# Altium schematic sheet cronometroArduino.SchDoc: CRONÓMETRO SUMO-MINISUMO
size 420 x 297 mm; Date: 11/05/2024; Author: I+D; CompanyName: IEEE; SheetNumber: 1; SheetTotal: 1
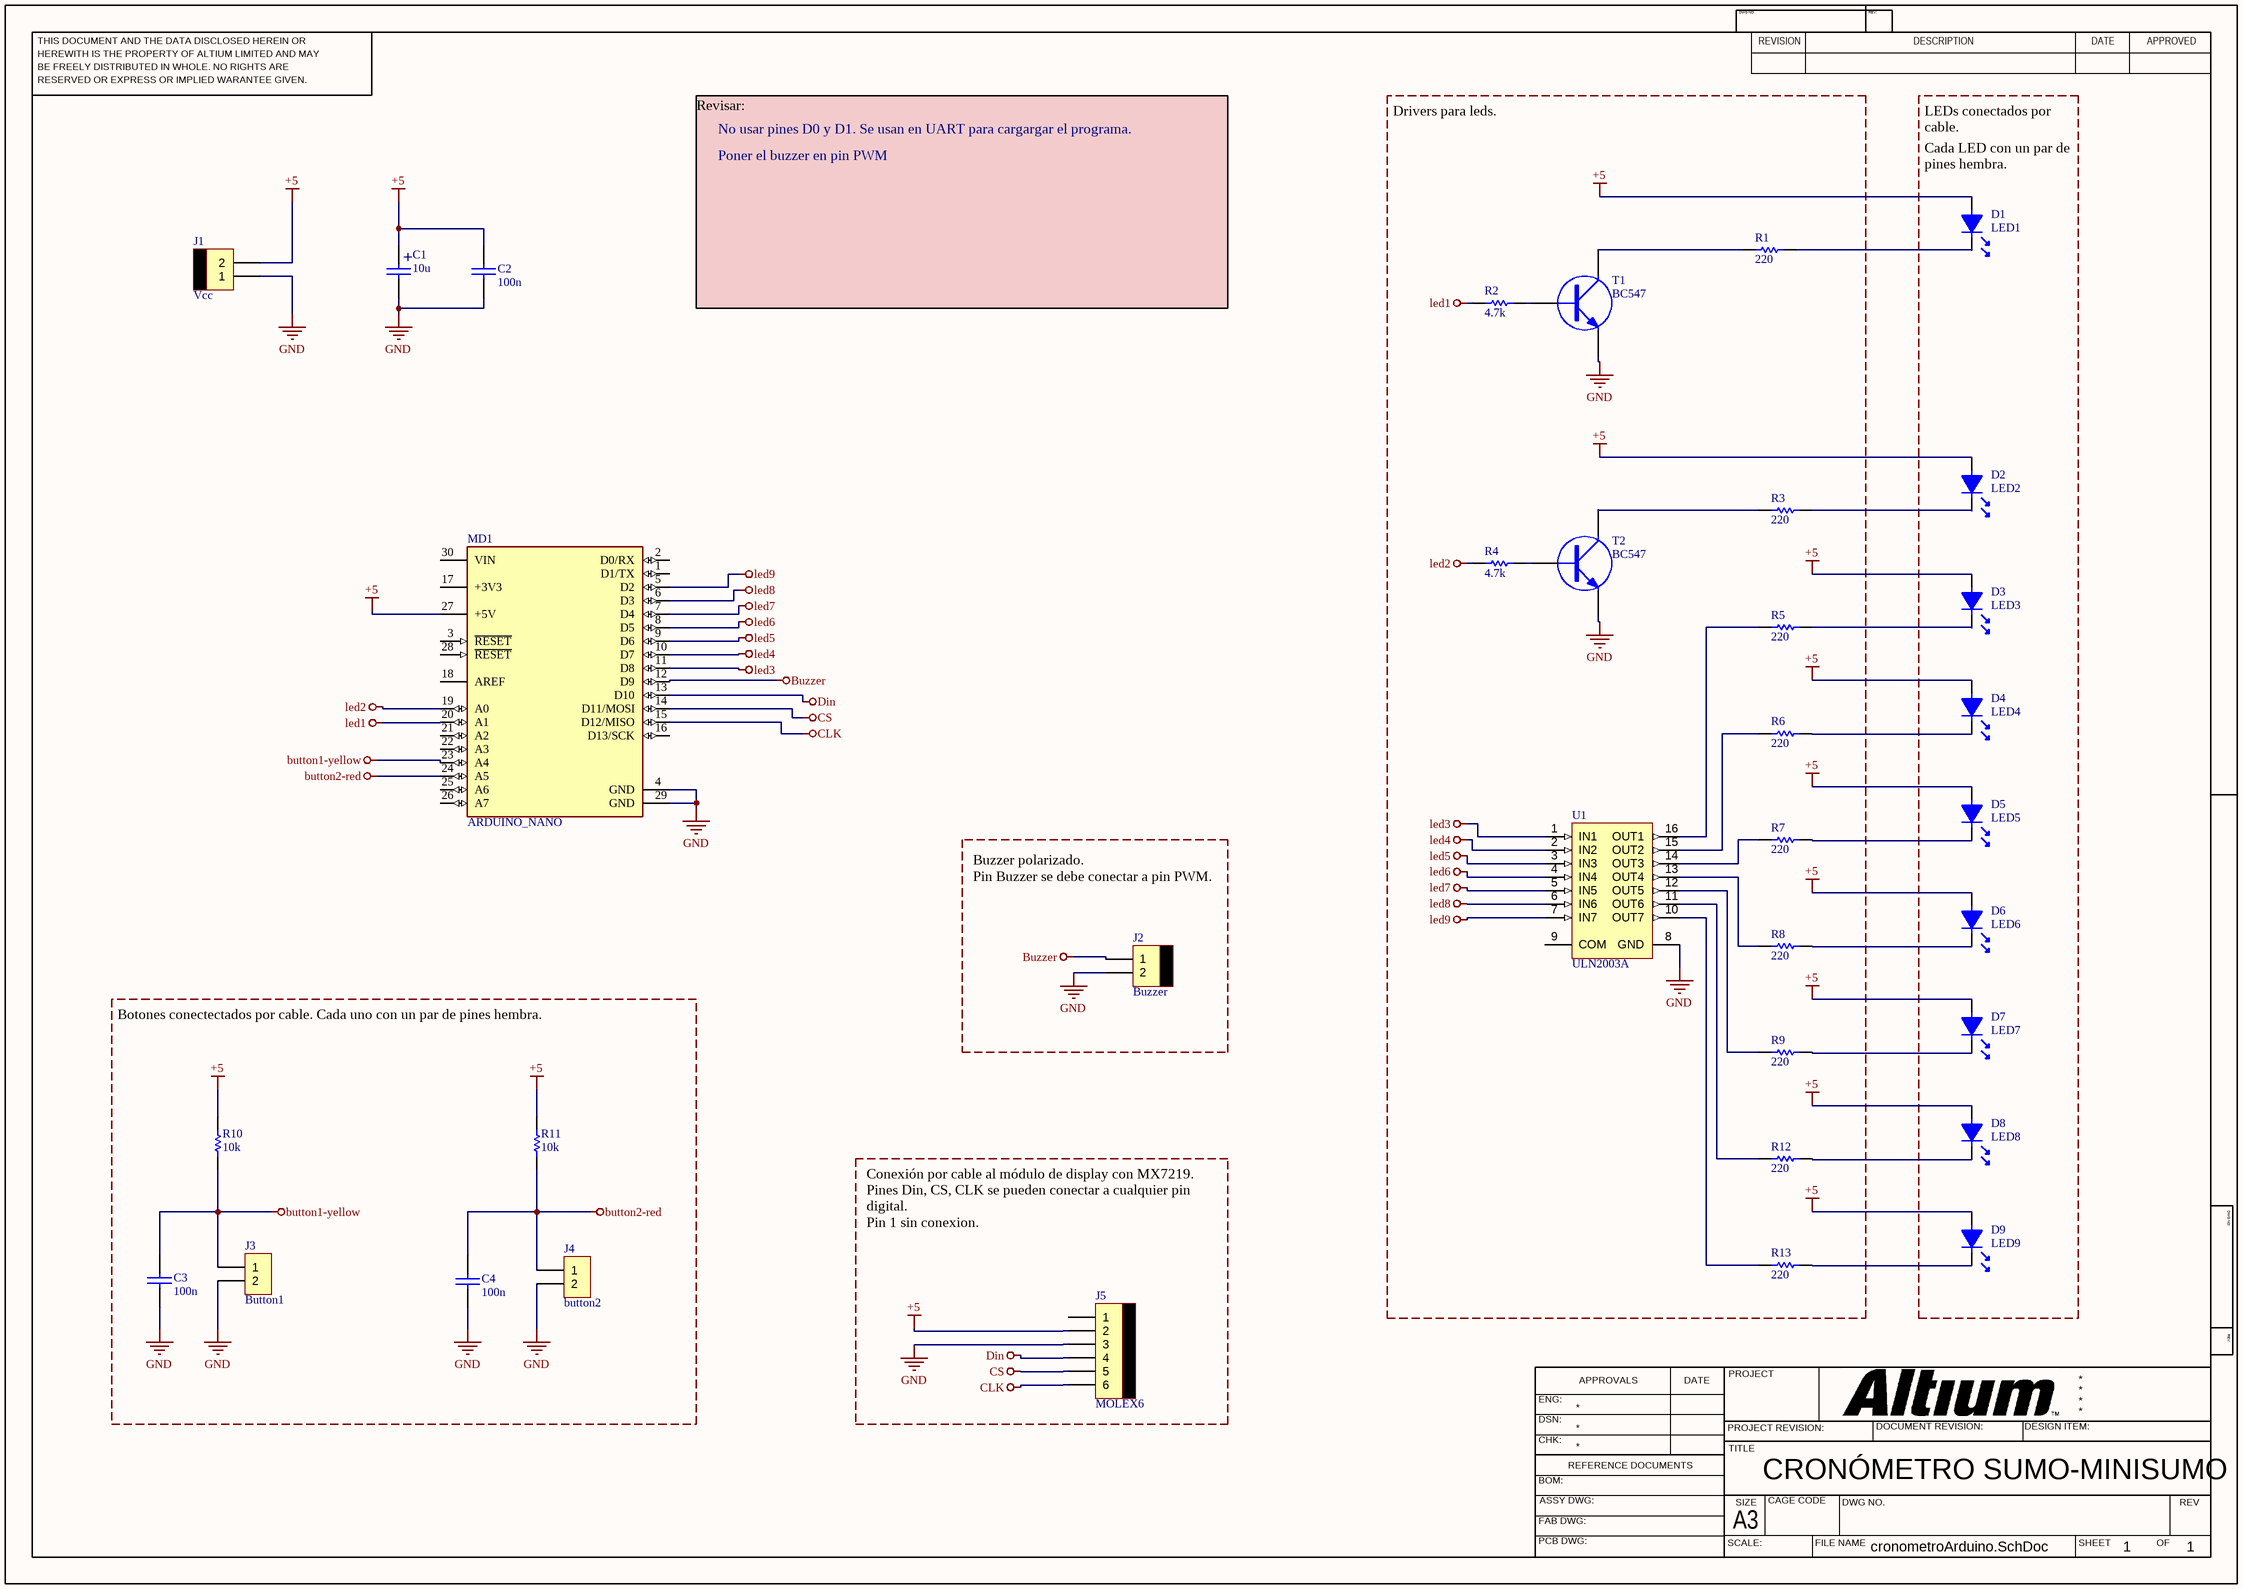
[diagram p0: cronometroArduino.SchDoc]

## Parts
C1  10u  [CAP100RP]
C2  100n  [CAP200]
C3  100n  [0805]
C4  100n  [0805]
D1  LED1  [LED3]
D2  LED2  [LED3]
D3  LED3  [LED3]
D4  LED4  [LED3]
D5  LED5  [LED3]
D6  LED6  [LED3]
D7  LED7  [LED3]
D8  LED8  [LED3]
D9  LED9  [LED3]
J1  Vcc  [MOLEX2]
J2  Buzzer  [MOLEX2]
J3  Button1  [SIP2]
J4  button2  [SIP2]
J5  MOLEX6  [MOLEX6]
MD1  ARDUINO_NANO  [FP-A000005-MFG]
R1  220  [RES400]
R2  4.7k  [0805]
R3  220  [RES400]
R4  4.7k  [0805]
R5  220  [RES400]
R6  220  [RES400]
R7  220  [RES400]
R8  220  [RES400]
R9  220  [RES400]
R10  10k  [0805]
R11  10k  [0805]
R12  220  [RES400]
R13  220  [RES400]
T1  BC547  [TO92]
T2  BC547  [TO92]
U1  ULN2003A  [STM-DIP-16L]

## Nets
+5: C1.1 C2.1 D1.1 D2.1 D3.1 D4.1 D5.1 D6.1 D7.1 D8.1 D9.1 J1.2 J5.2 MD1.27(+5V) R10.1 R11.1
button1-yellow: C3.1 J3.1 MD1.23(A4) R10.2
button2-red: C4.1 J4.1 MD1.24(A5) R11.2
Buzzer: J2.1 MD1.12(D9)
CLK: J5.6 MD1.15(D12/MISO)
CS: J5.5 MD1.14(D11/MOSI)
Din: J5.4 MD1.13(D10)
GND: C1.2 C2.2 C3.2 C4.2 J1.1 J2.2 J3.2 J4.2 J5.3 MD1.4(GND) MD1.29(GND) T1.3(E) T2.3(E) U1.8(GND)
led1: MD1.20(A1) R2.1
led2: MD1.19(A0) R4.1
led3: MD1.11(D8) U1.1(IN1)
led4: MD1.10(D7) U1.2(IN2)
led5: MD1.9(D6) U1.3(IN3)
led6: MD1.8(D5) U1.4(IN4)
led7: MD1.7(D4) U1.5(IN5)
led8: MD1.6(D3) U1.6(IN6)
led9: MD1.5(D2) U1.7(IN7)
NetD1_2: D1.2 R1.2
NetD2_2: D2.2 R3.2
NetD3_2: D3.2 R5.2
NetD4_2: D4.2 R6.2
NetD5_2: D5.2 R7.2
NetD6_2: D6.2 R8.2
NetD7_2: D7.2 R9.2
NetD8_2: D8.2 R12.2
NetD9_2: D9.2 R13.2
NetR1_1: R1.1 T1.2(C)
NetR2_2: R2.2 T1.1(B)
NetR3_1: R3.1 T2.2(C)
NetR4_2: R4.2 T2.1(B)
NetR5_1: R5.1 U1.16(OUT1)
NetR6_1: R6.1 U1.15(OUT2)
NetR7_1: R7.1 U1.14(OUT3)
NetR8_1: R8.1 U1.13(OUT4)
NetR9_1: R9.1 U1.12(OUT5)
NetR12_1: R12.1 U1.11(OUT6)
NetR13_1: R13.1 U1.10(OUT7)

Not connected (* = marked no-connect by the designer): J5 1; MD1 1(D1/TX) 2(D0/RX) 3(~{RESET}) 16(D13/SCK) 17(+3V3) 18(AREF) 21(A2) 22(A3) 25(A6) 26(A7) 28(~{RESET}) 30(VIN); U1 9(COM)

## Notes on the sheet
- No usar pines D0 y D1. Se usan en UART para cargargar el programa.
- Poner el buzzer en pin PWM
- Drivers para leds.
- LEDs conectados por cable.
- (near D1) Cada LED con un par de pines hembra.
- Text
- Revisar:
- (near J2) Buzzer polarizado.
  Pin Buzzer se debe conectar a pin PWM.
- Botones conectectados por cable. Cada uno con un par de pines hembra.
- Conexión por cable al módulo de display con MX7219.
  Pines Din, CS, CLK se pueden conectar a cualquier pin digital.
  Pin 1 sin conexion.
- THIS DOCUMENT AND THE DATA DISCLOSED HEREIN OR
- HEREWITH IS THE PROPERTY OF ALTIUM LIMITED AND MAY
- DWG NO:
- REVISION
- REV:
- DESCRIPTION
- DATE
- APPROVED
- BE FREELY DISTRIBUTED IN WHOLE. NO RIGHTS ARE
- RESERVED OR EXPRESS OR IMPLIED WARANTEE GIVEN.
- ENG:
- APPROVALS
- PROJECT
- DSN:
- CHK:
- REFERENCE DOCUMENTS
- PROJECT REVISION:
- TITLE
- DOCUMENT REVISION:
- DESIGN ITEM:
- BOM:
- FAB DWG:
- PCB DWG:
- ASSY DWG:
- SCALE:
- A3
- SIZE
- CAGE CODE
- FILE NAME
- DWG NO.
- SHEET
- OF
- REV
- (in symbol CAPPOL) +

## Library data of the parts
C1 = CAPPOL
C2-C4 = CAP
D1-D9 = LED
J1 = MOLEX2: Tensión de alimentación
J2 = MOLEX2
J3 J4 = CON2
MD1 = CMP-189986-000002-1: ARDUINO NANO ATMEGA328 EVAL BRD; Number of Bits: 8; Evaluation Kit: Yes; Operating Supply Voltage: 12V; Interface: I2C; Data Bus Width: 8b; Core Architecture: AVR; Packaging: Bulk; Length: 7inch; Package Quantity: 50; Width: 5inch; REACH SVHC: No SVHC; Weight: 0.358383oz; Series: AVR® ATmega; Height: 0.25inch
R1-R13 = RES
T1 T2 = TRANSISTOR NPN
U1 = CMP-2000-07351-1: Seven Darlington Array, 50 V, 0.5 A, -40 to 85 degC, 16-Pin DIP, RoHS, Tube; Manufacturer: STMicroelectronics; Transistor Polarity: NPN; VOUT: 50V; No. of Pins: 16Pins; SVHC: NoSVHC(17-Dec-2015); DC Current Gain hFE: 1000hFE; Output Current: 0.5A; DC Collector Current: 500mA; Transistor Case Style: DIP; Package Reference: DIP-16L; Automotive Qualification Standard: -; Mounting Technology: ThroughHole; Power Dissipation Pd: -; Collector Emitter Voltage V(br)ceo: 50V; Datasheet URL: http://www2.st.com/content/ccc/resource/technical/document/datasheet/f3/6e/c8/64/4d/b3/4e/38/CD00001244.pdf/files/CD00001244.pdf/jcr:content/translations/en.CD00001244.pdf; Manufacturer URL: http://www.st.com/; PartNumber: ULN2003A; MSL: MSL2-1year; Product Range: -; Package Description: 16-Pin DIP, Body 19.7 x 7.1 mm, Pitch 2.54 mm; Operating Temperature Max: 85°C; Datasheet Version: Rev. 8, 06/2012